# EAGLE board Yocto v2.007 (EAGLE 6.1), part 1 of 5
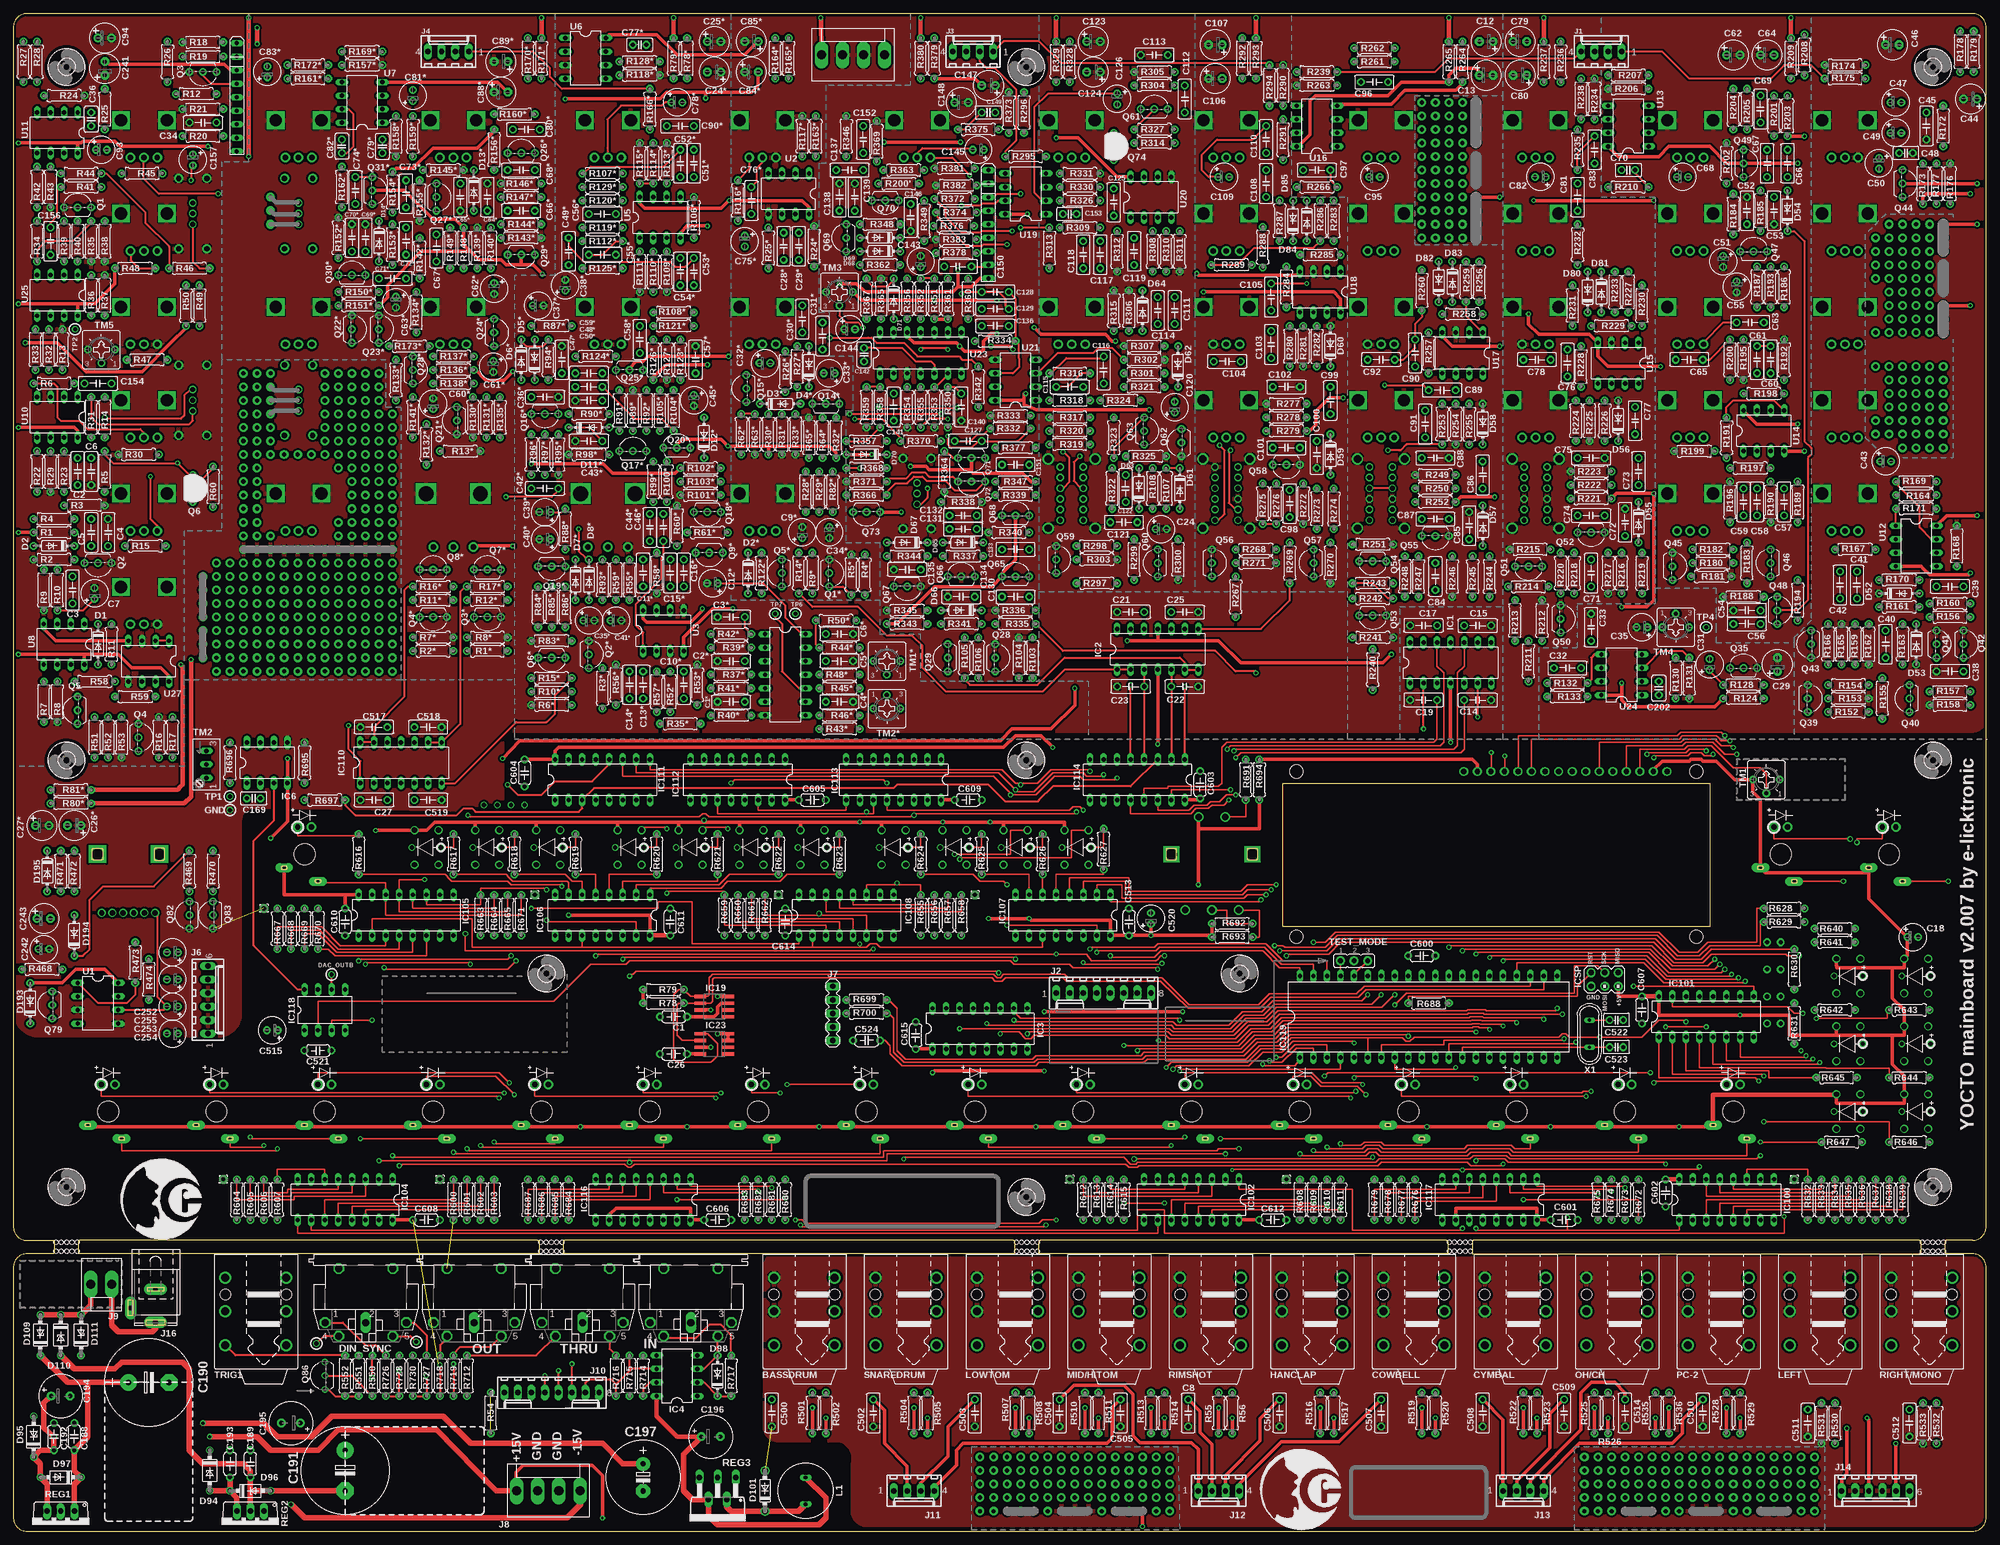
[diagram p19: board, top side]
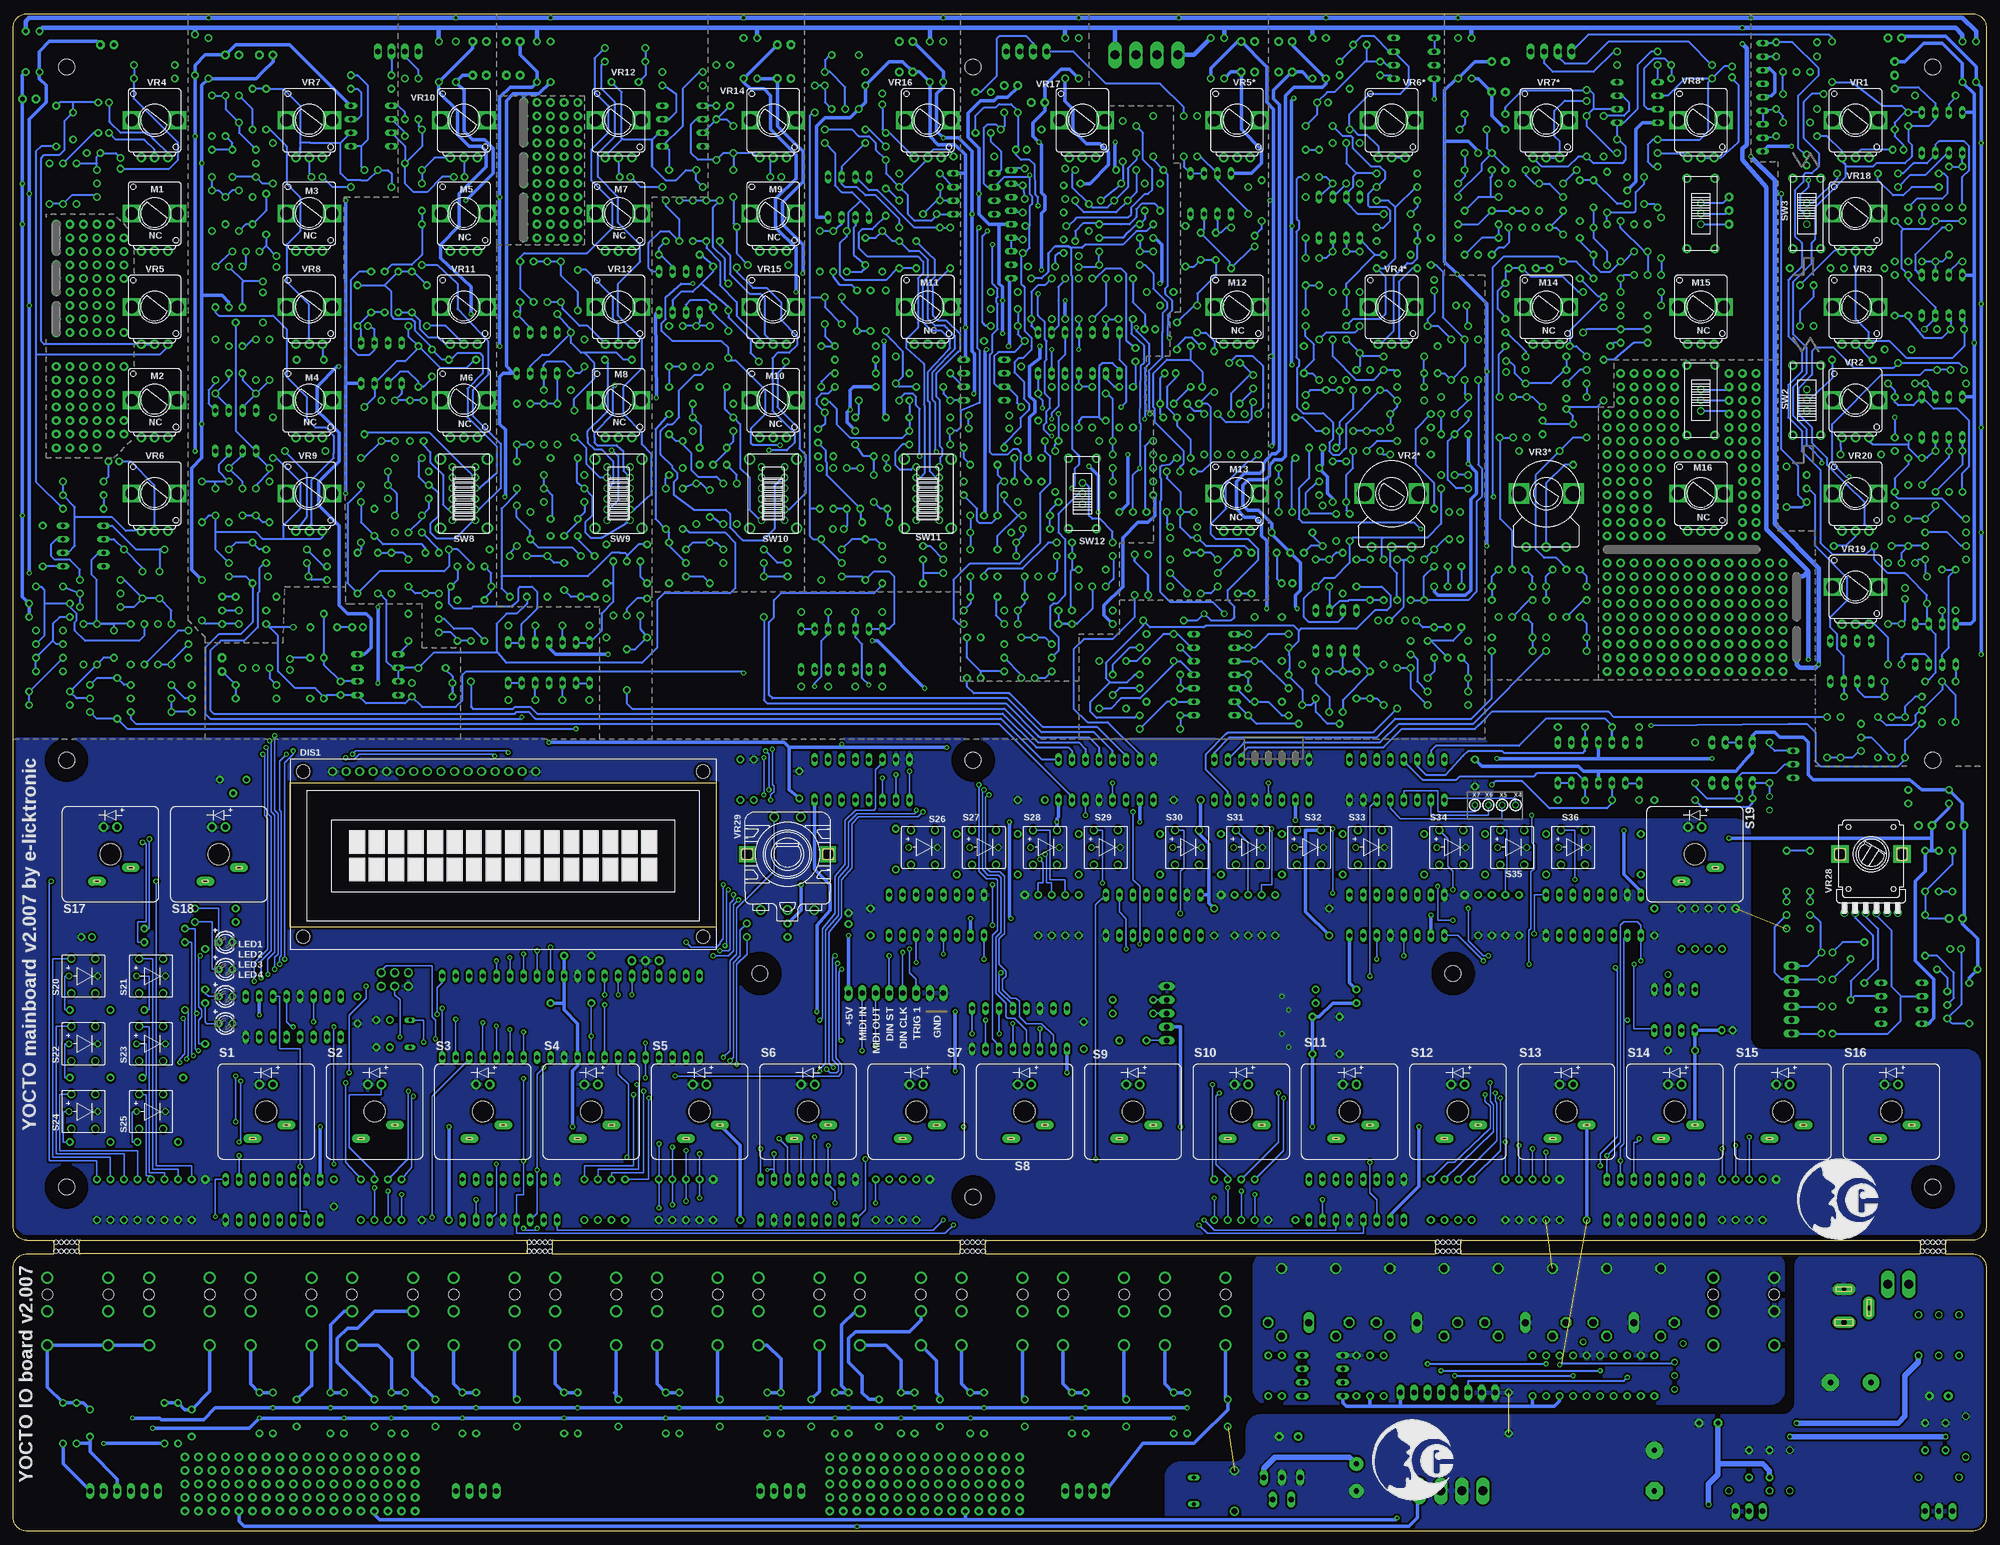
[diagram p20: board, bottom side, seen from below]

Size 370 x 284.55 mm. Coordinates in mm from the lower left corner, seen from the top.
Outline: 0,57.09 arc90 2.54,54.55 7.45,54.55 arc-90 7.7,54.3 7.7,52.25 arc-90 7.45,52 2.54,52 arc90 0,49.46 0,2.54 arc90 2.54,0 367.46,0 arc90 370,2.54 370,49.46 arc90 367.46,52 362.55,52 arc-90 362.3,52.25 362.3,54.3 arc-90 362.55,54.55 367.46,54.55 arc90 370,57.09 370,282.01 arc90 367.46,284.55 2.54,284.55 arc90 0,282.01 0,57.09
Outline: 98.35,54.55 12.55,54.55 arc90 12.3,54.3 12.3,52.25 arc90 12.55,52 98.35,52 arc90 98.6,52.25 98.6,54.3 arc90 98.35,54.55
Outline: 187.55,54.55 103.45,54.55 arc90 103.2,54.3 103.2,52.25 arc90 103.45,52 187.55,52 arc90 187.8,52.25 187.8,54.3 arc90 187.55,54.55
Outline: 268.75,54.55 192.65,54.55 arc90 192.4,54.3 192.4,52.25 arc90 192.65,52 268.75,52 arc90 269,52.25 269,54.3 arc90 268.75,54.55
Outline: 357.45,54.55 273.85,54.55 arc90 273.6,54.3 273.6,52.25 arc90 273.85,52 357.45,52 arc90 357.7,52.25 357.7,54.3 arc90 357.45,54.55
Outline: 318.13,113.29 238.12,113.29 238.12,140.28 318.13,140.28 318.13,113.29
Copper layers (1*16): Top 0.035mm / dielectric 1.5mm / Bottom 0.035mm
Design rules: minimum track width 10mil, minimum drill 10mil, track to track 8mil, track to pad 8mil, pad to pad 8mil, via to via 8mil, smd to smd 8mil, copper to edge 20mil, drill to drill 8mil, minimum pad ring 8mil, minimum via ring 8mil, stop-mask expansion 4mil, vias tented up to drill 24mil, thermal gap 10mil
Net classes: 0 default: width 0.381 mm, drill 0.254 mm, clearance 0.254 mm; 1 GND: width 0.762 mm, drill 0.254 mm, clearance 0.381 mm; 2 power: width 0.61 mm, drill 0.381 mm, clearance 0.381 mm; 3 special: width 0.254 mm, drill 0.254 mm, clearance 0.254 mm; 4 NOISE: width 0.381 mm, drill 0.254 mm, clearance 0.508 mm; 5 isolate: width 0.381 mm, drill 0.254 mm, clearance 1.016 mm
Holes 0.8 mm at 8,54.15 9,54.15 10,54.15 11,54.15 12,54.15 8,52.45 9,52.45 10,52.45 11,52.45 12,52.45 188.1,54.15 189.1,54.15 190.1,54.15 191.1,54.15 192.1,54.15 188.1,52.45 189.1,52.45 190.1,52.45 191.1,52.45 192.1,52.45 358,54.15 359,54.15 360,54.15 361,54.15 362,54.15 358,52.45 359,52.45 360,52.45 361,52.45 362,52.45 269.3,54.15 270.3,54.15 271.3,54.15 272.3,54.15 273.3,54.15 269.3,52.45 270.3,52.45 271.3,52.45 272.3,52.45 273.3,52.45 98.9,54.15 99.9,54.15 100.9,54.15 101.9,54.15 102.9,54.15 98.9,52.45 99.9,52.45 100.9,52.45 101.9,52.45 102.9,52.45

## Footprints (pad centres in the part's own frame; a part is rotated, then mirrored left to right if it is on the bottom)
JACK_TRS = drill 1.5: R -7.23,6.35; RN 4.2,6.35; S -7.23,12.7; SN 4.2,12.7; T -7.23,0; TN 4.2,0 | hole 2: -7.23,9.5; 4.2,9.5
C050-024X044 = drill 0.813 pad 1.422: 1 -2.54,0; 2 2.54,0
C050-025X075 = drill 0.813 pad 1.422: 1 -2.54,0; 2 2.54,0
E2-5 = drill 0.813 pad 1.422: + -1.016,0; - 1.016,0
E2,5-6 = drill 0.813 pad 1.6: + -1.27,0 | drill 0.813 pad 1.6 octagon: - 1.27,0
C025-025X050 = drill 0.813 pad 1.422: 1 -1.27,0; 2 1.27,0
E7,5-16 = drill 1.016 pad 3.15: + -3.81,0 | drill 1.016 pad 3.15 octagon: - 3.81,0
E3,5-8 = drill 0.813 pad 1.6: + -1.778,0 | drill 0.813 pad 1.6 octagon: - 1.778,0
E5-13 = drill 1.016 pad 2.54: + -2.54,0 | drill 1.016 pad 2.54 octagon: - 2.54,0
DO35-7C = drill 0.813 pad 1.422: A 3.81,0; C -3.81,0
DO35-7C@1 = drill 0.813 pad 1.422: A 3.81,0; C -3.81,0
DO41-7 = drill 0.9: A 3.81,0; C -3.81,0
DO41-7.6 = drill 1.1 pad 1.7: A 3.81,0; C -3.81,0
B0,8 = drill 0.8: P$1 0,0
MAB5SH = drill 1.321 octagon: 1 7.62,5.08; 3 -7.62,5.08; 4 5.08,7.62; 5 -5.08,7.62; PE -5.08,-5.08; PE@ 5.08,-5.08 | drill 1.321 long: 2 0,5.08
TUXGR_16X2_R2 = drill 1 pad 1.676: 1 -32,15.5; 2 -29.46,15.5; 3 -26.92,15.5; 4 -24.38,15.5; 5 -21.84,15.5; 6 -19.3,15.5; 7 -16.76,15.5; 8 -14.22,15.5; 9 -11.68,15.5; 10 -9.14,15.5; 11 -6.6,15.5; 12 -4.06,15.5; 13 -1.52,15.5; 14 1.02,15.5; 15 3.56,15.5; 16 6.1,15.5 | hole 2.5: -37.5,-15.5; 37.5,-15.5; -37.5,15.5; 37.5,15.5
1,6/0,8 = drill 0.813 pad 1.6 octagon: 1 0,0
DIL14 = drill 0.813 long: 1 -7.62,-3.81; 2 -5.08,-3.81; 3 -2.54,-3.81; 4 0,-3.81; 5 2.54,-3.81; 6 5.08,-3.81; 7 7.62,-3.81; 8 7.62,3.81; 9 5.08,3.81; 10 2.54,3.81; 11 0,3.81; 12 -2.54,3.81; 13 -5.08,3.81; 14 -7.62,3.81
DIL16 = drill 0.813 long: 1 -8.89,-3.81; 2 -6.35,-3.81; 3 -3.81,-3.81; 4 -1.27,-3.81; 5 1.27,-3.81; 6 3.81,-3.81; 7 6.35,-3.81; 8 8.89,-3.81; 9 8.89,3.81; 10 6.35,3.81; 11 3.81,3.81; 12 1.27,3.81; 13 -1.27,3.81; 14 -3.81,3.81; 15 -6.35,3.81; 16 -8.89,3.81
DIL08 = drill 0.813 long: 1 -3.81,-3.81; 2 -1.27,-3.81; 3 1.27,-3.81; 4 3.81,-3.81; 5 3.81,3.81; 6 1.27,3.81; 7 -1.27,3.81; 8 -3.81,3.81
DIL08' = drill 0.813 pad 1.27 long: 1 -3.81,-3.81; 2 -1.27,-3.81; 3 1.27,-3.81; 4 3.81,-3.81; 5 3.81,3.81; 6 1.27,3.81; 7 -1.27,3.81; 8 -3.81,3.81
SO08 = smd 0.6 x 2.2: 1 -1.905,-2.6; 2 -0.635,-2.6; 3 0.635,-2.6; 4 1.905,-2.6; 5 1.905,2.6; 6 0.635,2.6; 7 -0.635,2.6; 8 -1.905,2.6
DIL8 = drill 0.813 long: 1 -3.81,-3.81; 2 -1.27,-3.81; 3 1.27,-3.81; 4 3.81,-3.81; 5 3.81,3.81; 6 1.27,3.81; 7 -1.27,3.81; 8 -3.81,3.81
DIL40 = drill 0.813 long: 1 -24.13,-7.62; 2 -21.59,-7.62; 3 -19.05,-7.62; 4 -16.51,-7.62; 5 -13.97,-7.62; 6 -11.43,-7.62; 7 -8.89,-7.62; 8 -6.35,-7.62; 9 -3.81,-7.62; 10 -1.27,-7.62; 11 1.27,-7.62; 12 3.81,-7.62; 13 6.35,-7.62; 14 8.89,-7.62; 15 11.43,-7.62; 16 13.97,-7.62; 17 16.51,-7.62; 18 19.05,-7.62; 19 21.59,-7.62; 20 24.13,-7.62; 21 24.13,7.62; 22 21.59,7.62; 23 19.05,7.62; 24 16.51,7.62; 25 13.97,7.62; 26 11.43,7.62; 27 8.89,7.62; 28 6.35,7.62; 29 3.81,7.62; 30 1.27,7.62; 31 -1.27,7.62; 32 -3.81,7.62; 33 -6.35,7.62; 34 -8.89,7.62; 35 -11.43,7.62; 36 -13.97,7.62; 37 -16.51,7.62; 38 -19.05,7.62; 39 -21.59,7.62; 40 -24.13,7.62
MA03-2 = drill 1.016 pad 1.676: 1 -2.54,-1.27; 2 -2.54,1.27; 3 0,-1.27; 4 0,1.27; 5 2.54,-1.27; 6 2.54,1.27
6410-04 = drill 1.016 long: 1 3.81,0; 2 1.27,0; 3 -1.27,0; 4 -3.81,0
6410-08 = drill 1.016 long: 1 8.89,0; 2 6.35,0; 3 3.81,0; 4 1.27,0; 5 -1.27,0; 6 -3.81,0; 7 -6.35,0; 8 -8.89,0
KK-156-4 = drill 1.7 pad 2.184 long: 1 -5.94,0; 2 -1.98,0; 3 1.98,0; 4 5.94,0
6410-06 = drill 1.016 long: 1 6.35,0; 2 3.81,0; 3 1.27,0; 4 -1.27,0; 5 -3.81,0; 6 -6.35,0
MA05-1A = drill 1.016 long: 1 -5.08,0; 2 -2.54,0; 3 0,0; 4 2.54,0; 5 5.08,0
KK-156-2 = drill 1.7 pad 2.184 long: 1 -1.98,0; 2 1.98,0
JACK_PSU_2.1MM = drill 0.8 pad 2.184 long: 1 -3.5,0; 2 0,-4.7 | drill 1 pad 2.184 long: 3 2.7,0
BS11 = drill 0.7 long: 1 -2.5,0; 2 2.5,0
LED3MM = drill 0.813 pad 1.422: A -1.27,0; K 1.27,0
R0903N = drill 1 pad 1.778: 1 -2.5,-7; 2 0,-7; 3 2.5,-7 | drill 2.3 square: P$4 -4.3,0; P$5 4.3,0
MSS12_SW_SLIDE = drill 0.9: 1 -2,0; 2 0,0; 3 2,0 | drill 1 pad 1.676: P$4 -6.6,2.65; P$5 6.6,2.65; P$6 6.6,-2.65; P$7 -6.6,-2.65
1.6/0.8ROUND = drill 0.813 pad 1.6: 1 0,0
TO-92-ECB-PERSO = drill 0.813 pad 1.422: B 2.54,0; C 0,0; E -2.54,0
TO-92-ECB-MARKED = drill 0.8 pad 1.422: B 2.54,0; C 0,0; E -2.54,0
TO-92-MARKED_FET = drill 0.813 pad 1.422: D 2.54,0; G 0,0; S -2.54,0
TO-ECB-MARKED2 = drill 0.8 pad 1.422: B 2.54,0; C 0,0; E -2.54,0
TO92-ECB = drill 0.813 pad 1.422: B 2.54,0; C 0,0; E -2.54,0
TO92-EBC-SMALL = drill 0.813: B 0,0; C -2.54,0; E 2.54,0
0207/7 = drill 0.813 pad 1.422: 1 -3.81,0; 2 3.81,0
TO220V = drill 1.016 long: 1 -2.54,-2.54; 2 0,-2.54; 3 2.54,-2.54
T05D = drill 1.016 long: 1 -3.404,-5.08; 2 -1.702,-0.914; 3 0,-5.08; 4 1.702,-0.914; 5 3.404,-5.08
MX1A-SW = drill 0.5 pad 1.676 long: 1 -2.54,-5.08; 2 3.81,-2.54 | drill 1 pad 1.778: A 1.27,5.08; K -1.27,5.08 | hole 3.95: 0,0
SPH_SW = drill 1: 1 -2.25,3.25; 2 -2.25,-3.25; 3 2.25,3.25; 4 2.25,-3.25 | drill 0.8: A -2.7,0; K 2.7,0
MSS42_SW_SLIDE = drill 0.9: 1A -2.15,5; 1B 2.15,5; 1C -2.15,-1; 1D 2.15,-1; 2A -2.15,1; 2B 2.15,1; 2C -2.15,-5; 2D 2.15,-5; CA -2.15,3; CB 2.15,3; CC -2.15,-3; CD 2.15,-3 | drill 1.4: P$1 -4.4,6.5; P$2 4.4,6.5; P$3 4.4,-6.5; P$4 -4.4,-6.5
JP2 = drill 0.914 pad 1.676: 1 -2.54,0; 2 0,0; 3 2.54,0
CT6 = drill 0.813 pad 1.422: A 2.515,0; E -2.515,0; S 0,-2.54
S64W = drill 0.813 long: A 2.54,1.27; E -2.54,1.27; S 0,1.27
SIL09 = drill 0.8 long: 1 10.16,0; 2 7.62,0; 3 5.08,0; 4 2.54,0; 5 0,0; 6 -2.54,0; 7 -5.08,0; 8 -7.62,0; 9 -10.16,0
3,0 = hole 3: 0,0
R1212N = drill 1 pad 1.778: 1 -3.75,-10; 2 0,-10; 3 3.75,-10 | drill 2.8 square: P$4 -5.1,0; P$5 5.1,0
PTV112-4 = drill 1: 1 -3,-11; 1' -1,-11; 2 -5,-11; 2' 1,-11; 3 5,-11; 3' 3,-11 | drill 2 pad 3.302 square: P$1 -5.8,0; P$2 5.8,0
PEC16_ENCODER = drill 1.2: A -5,-10.5; B 0,-10.5; C 5,-10.5; D -2.5,7; E 2.5,7 | drill 2 square: P$6 -7.6,0; P$7 7.6,0
QS = drill 0.61 long: 1 -2.54,0; 2 2.54,0

## Placement (x,y rotation side)
BASSDRUM  JACK_TRSNRJ6HF  [JACK_TRS]  149.86,34.87 0 top
C1  0.1  [C050-024X044]  123.83,96.46 180 top
C1*  18n  [C050-025X075]  134.62,155.52 0 top
C2  3n3  [C050-025X075]  12.06,198.7 270 top
C2*  10n  [C050-025X075]  134.62,163.14 0 top
C3  47n  [C050-025X075]  11.11,176.47 90 top
C3*  10n  [C050-025X075]  134.62,171.39 0 top
C4  47n  [C050-025X075]  17.78,187.27 270 top
C4*  18n  [C050-025X075]  154.94,155.52 180 top
C5  47n  [C050-025X075]  14.61,187.27 270 top
C5*  18n  [C050-025X075]  154.94,163.14 180 top
C6  47n  [C050-025X075]  14.61,198.7 90 top
C6*  22n  [C050-025X075]  154.94,168.22 180 top
C7  2.2/50  [E2-5]  15.24,175.84 90 top
C8  0.01  [C050-025X075]  220.34,22.17 90 top
C9*  .47/50  [E2-5]  147.96,187.27 90 top
C10*  3.3n  [C050-025X075]  125.73,158.69 90 top
C11*  1n  [C050-025X075]  118.11,179.65 90 top
C12  47/16  [E2,5-6]  276.23,279.34 180 top
C12*  100/6.3  [E2-5]  131.13,177.74 180 top
C13  47/16  [E2,5-6]  276.23,272.99 0 top
C13*  6.8n  [C050-025X075]  118.11,158.69 270 top
C14  470p  [C050-025X075]  274.64,155.84 0 top
C14*  6.8n  [C050-025X075]  115.57,158.69 90 top
C15  470p  [C050-025X075]  274.64,169.81 0 top
C15*  3.3n  [C050-025X075]  123.19,179.65 90 top
C16*  3.3n  [C050-025X075]  125.73,179.65 270 top
C17  470p  [C050-025X075]  264.48,169.81 180 top
C18  100/6.3  [E2-5]  356.24,111.39 0 top
C19  470p  [C050-025X075]  264.48,155.84 180 top
C21  470p  [C050-025X075]  209.55,172.34 180 top
C22  470p  [C050-025X075]  219.71,158.38 0 top
C23  470p  [C050-025X075]  209.55,158.38 180 top
C24  .47/50  [E2-5]  215.26,187.9 0 top
C24*  47/16  [E2,5-6]  131.44,273.63 180 top
C25  470p  [C050-025X075]  219.71,172.34 0 top
C25*  47/16  [E2,5-6]  131.44,279.34 0 top
C26  0.1  [C050-024X044]  123.83,89.48 180 top
C26*  47/16  [E2,5-6]  11.43,132.34 180 top
C27  470p  [C050-025X075]  67.63,137.1 180 top
C27*  47/16  [E2,5-6]  5.4,132.34 0 top
C28*  10n  [C050-025X075]  144.46,240.93 90 top
C29  47/16  [E2,5-6]  330.83,162.5 90 top
C29*  3.3n  [C050-025X075]  147.32,240.93 90 top
C30*  2.2n  [C050-025X075]  147.96,227.27 90 top
C31  1/50  [E2-5]  318.13,162.5 90 top
C31*  2.2n  [C050-025X075]  151.76,224.1 90 top
C32  39n  [C050-025X075]  291.46,161.87 0 top
C32*  10/16  [E2-5]  140.97,219.02 0 top
C33  18n  [C050-025X075]  295.91,169.49 90 top
C33*  10/16  [E2-5]  153.03,217.11 180 top
C34  1n  [C050-025X075]  35.56,264.1 0 top
C34*  1/50  [E2-5]  153.03,187.27 270 top
C35  10/16  [E2-5]  305.44,169.49 180 top
C35*  47/16  [E2-5]  107.95,170.76 0 top
C36  220p  [C025-025X050]  14.61,264.74 270 top
C36*  1.5n  [C050-025X075]  99.69,212.67 0 top
C37*  2.2/50  [E2-5]  98.42,229.81 0 top
C38  100n  [C050-025X075]  363.22,161.23 180 top
C38*  1/50  [E2-5]  103.5,233.62 90 top
C39  33n  [C050-025X075]  363.22,177.11 180 top
C39*  .47/50  [E2-5]  99.69,191.08 180 top
C40  15n  [C050-025X075]  351.15,166.31 90 top
C40*  1/50  [E2-5]  99.69,186 180 top
C41  15n  [C050-025X075]  345.76,177.43 270 top
C41*  1/50  [E2-5]  113.03,170.76 0 top
C42  15n  [C050-025X075]  342.58,177.43 90 top
C42*  22n  [C050-025X075]  99.69,195.52 180 top
C43  33/6.3  [E2-5]  351.15,200.6 0 top
C43*  1.5n  [C050-025X075]  107.95,204.41 0 top
C44  47/16  [E2,5-6]  367.03,268.55 180 top
C44*  22n  [C050-025X075]  119.38,188.22 90 top
C45  100n  [C050-025X075]  358.77,263.47 270 top
C45*  2.2/50  [E2-5]  127.64,212.03 270 top
C46  47/16  [E2,5-6]  352.43,278.71 0 top
C46*  22n  [C050-025X075]  121.92,188.22 90 top
C47  .47/50  [E2-5]  353.06,267.91 0 top
C47*  1.5n  [C050-025X075]  102.87,219.65 90 top
C48  220p  [C025-025X050]  354.96,258.39 180 top
C48*  1.5n  [C050-025X075]  107.95,214.57 180 top
C49  .47/50  [E2-5]  353.06,262.2 0 top
C49*  3.3n  [C050-025X075]  104.14,239.97 90 top
C50  1/50  [E2-5]  349.88,256.48 270 top
C50*  1.5n  [C050-025X075]  107.95,212.03 0 top
C51  .47/50  [E2-5]  320.68,238.07 270 top
C51*  1n  [C050-025X075]  127.64,256.48 90 top
C52  100n  [C050-025X075]  325.12,247.59 90 top
C52*  1n  [C050-025X075]  125.09,256.48 270 top
C53  1n  [C050-025X075]  330.2,247.59 270 top
C53*  1n  [C050-025X075]  127.64,236.16 270 top
C54  2.7n  [C050-025X075]  325.12,172.66 180 top
C54*  1n  [C050-025X075]  125.09,236.16 90 top
C55  47/16  [E2-5]  323.21,233.31 270 top
C55*  10n  [C050-025X075]  110.49,239.34 180 top
C56  22n  [C050-025X075]  325.12,170.12 180 top
C56*  10n  [C050-025X075]  110.49,246.96 180 top
C57  6.8n  [C050-025X075]  332.11,192.98 90 top
C57*  3.3n  [C050-025X075]  127.95,219.65 90 top
C58  27n  [C050-025X075]  327.02,192.98 270 top
C58*  10n  [C050-025X075]  117.47,223.46 90 top
C59  27n  [C050-025X075]  324.49,192.98 90 top
C59*  1.5n  [C050-025X075]  107.95,217.11 0 top
C60  6.8n  [C050-025X075]  329.56,219.65 90 top
C60*  10/16  [E2-5]  78.74,211.4 90 top
C61  6.8n  [C050-025X075]  327.02,219.65 270 top
C61*  47/16  [E2-5]  90.01,218.38 270 top
C62  47/16  [E2,5-6]  322.58,276.8 0 top
C62*  .47/50  [E2-5]  90.17,232.99 270 top
C63  47n  [C050-025X075]  325.75,226.64 180 top
C63*  .47/50  [E2-5]  71.75,230.45 270 top
C64  47/16  [E2,5-6]  328.93,276.8 0 top
C64*  1.5n  [C050-025X075]  88.9,250.13 90 top
C65  47n  [C050-025X075]  314.32,219.65 180 top
C65*  1.5n  [C050-025X075]  83.82,250.13 270 top
C66  1.8n  [C050-025X075]  332.74,256.48 90 top
C66*  1.5n  [C050-025X075]  95.25,247.59 0 top
C67  1.8n  [C050-025X075]  328.93,256.48 270 top
C67*  22n  [C050-025X075]  79.38,240.61 90 top
C68  33/6.3  [E2-5]  313.06,253.94 0 top
C68*  1.5n  [C050-025X075]  95.25,255.21 0 top
C69  10n  [C050-025X075]  327.66,266.64 90 top
C69*  1.5n  [C050-025X075]  66.04,242.51 90 top
C70  220p  [C025-025X050]  302.89,255.21 0 top
C70*  1.5n  [C050-025X075]  63.5,242.51 90 top
C71  47n  [C050-025X075]  295.91,179.65 90 top
C71*  22n  [C050-025X075]  71.12,234.89 180 top
C72  39n  [C050-025X075]  302.26,189.17 90 top
C72*  1n  [C050-025X075]  73.66,241.88 90 top
C73  6.8n  [C050-025X075]  304.8,198.7 90 top
C73*  1n  [C050-025X075]  73.66,250.77 90 top
C74  47n  [C050-025X075]  295.91,190.44 0 top
C74*  470p  [C050-025X075]  64.14,251.4 270 top
C75  18n  [C050-025X075]  295.91,201.24 0 top
C75*  1/50  [E2-5]  137.16,241.88 270 top
C76  56n  [C050-025X075]  291.46,219.02 90 top
C76*  22n  [C050-025X075]  138.43,249.5 270 top
C77  47n  [C050-025X075]  304.17,208.22 270 top
C77*  220p  [C025-025X050]  117.47,278.71 0 top
C78  12n  [C050-025X075]  285.75,219.65 180 top
C78*  33/6.3  [E2-5]  124.46,267.91 0 top
C79  47/16  [E2,5-6]  282.57,279.34 0 top
C79*  220p  [C025-025X050]  69.22,259.66 90 top
C80  47/16  [E2,5-6]  282.57,272.99 180 top
C80*  470p  [C050-025X075]  96.2,262.83 0 top
C81  47n  [C050-025X075]  293.37,250.13 90 top
C81*  33/6.3  [E2-5]  74.93,269.18 90 top
C82  33/6.3  [E2-5]  286.38,253.94 180 top
C82*  220p  [C025-025X050]  61.59,259.66 270 top
C83  1n  [C050-025X075]  296.55,259.02 270 top
C83*  33/6.3  [E2-5]  47.62,273.63 90 top
C84  47n  [C050-025X075]  266.7,179.01 90 top
C84*  47/16  [E2,5-6]  138.43,273.63 0 top
C85  33n  [C050-025X075]  273.05,188.54 90 top
C85*  47/16  [E2,5-6]  138.43,279.34 180 top
C86  2.7n  [C050-025X075]  275.59,198.06 90 top
C87  33n  [C050-025X075]  266.7,189.81 0 top
C88  15n  [C050-025X075]  266.7,201.24 0 top
C88*  47/16  [E2,5-6]  91.44,269.82 0 top
C89  8.2n  [C050-025X075]  267.97,213.94 0 top
C89*  47/16  [E2,5-6]  91.44,275.53 180 top
C90  27n  [C050-025X075]  262.89,220.92 90 top
C90*  10n  [C050-025X075]  125.09,263.47 0 top
C91  27n  [C050-025X075]  264.8,207.59 270 top
C92  12n  [C050-025X075]  256.54,219.65 180 top
C93  33/6.3  [E2-5]  16.51,259.02 0 top
C94  47/16  [E2,5-6]  17.14,279.98 0 top
C95  33/6.3  [E2-5]  255.27,253.94 0 top
C96  39n  [C050-025X075]  255.27,271.72 0 top
C97  1n  [C050-025X075]  244.47,255.21 0 top
C98  47n  [C050-025X075]  239.4,192.67 90 top
C99  2.7n  [C050-025X075]  247.01,212.03 90 top
C100  33n  [C050-025X075]  244.47,201.87 270 top
C101  27n  [C050-025X075]  238.76,203.14 0 top
C102  10n  [C050-025X075]  238.76,214.57 0 top
C103  27n  [C050-025X075]  235.9,222.51 270 top
C104  22n  [C050-025X075]  227.65,219.34 180 top
C105  5.6n  [C050-025X075]  235.9,231.4 270 top
C106  47/16  [E2,5-6]  225.43,272.36 0 top
C107  47/16  [E2,5-6]  225.43,278.71 180 top
C108  33n  [C050-025X075]  234.95,252.67 90 top
C109  33/6.3  [E2-5]  227.01,253.94 0 top
C110  1n  [C050-025X075]  234.95,260.93 90 top
C111  10n  [C050-025X075]  217.81,228.86 270 top
C112  22n  [C050-025X075]  219.71,268.55 90 top
C113  47n  [C050-025X075]  214,276.8 180 top
C114  1n  [C050-025X075]  214.63,228.86 270 top
C115  4.7n  [C050-025X075]  198.12,214.57 0 top
C116  4.7n  [C050-025X075]  204.47,217.75 90 top
C117  2.2n  [C050-025X075]  203.84,239.34 90 top
C118  2.2n  [C050-025X075]  200.66,239.34 90 top
C119  2.2n  [C050-025X075]  210.19,239.97 270 top
C120  10/16  [E2-5]  217.81,210.76 90 top
C121  4.7n  [C050-025X075]  208.28,189.17 180 top
C122  4.7n  [C050-025X075]  208.6,195.52 90 top
C123  47/16  [E2,5-6]  202.56,279.34 0 top
C124  47/16  [E2,5-6]  202.56,273.63 180 top
C125  10n  [C050-025X075]  206.38,249.18 90 top
C126  33/6.3  [E2-5]  207.01,268.55 270 top
C127  1.8n  [C050-025X075]  179.07,204.41 0 top
C128  4.7n  [C050-025X075]  184.15,232.35 180 top
C129  4.7n  [C050-025X075]  184.15,229.18 180 top
C130  47n  [C050-025X075]  187.96,175.2 0 top
C131  10n  [C050-025X075]  178.12,187.9 0 top
C132  1n  [C050-025X075]  178.12,190.44 180 top
C133  1n  [C050-025X075]  187.96,184.09 180 top
C134  33n  [C050-025X075]  177.8,175.2 180 top
C135  100n  [C050-025X075]  167.64,180.28 180 top
C136  22n  [C050-025X075]  184.15,226 0 top
C137  33n  [C050-025X075]  156.84,255.21 0 top
C138  47n  [C050-025X075]  154.94,250.13 90 top
C139  18n  [C050-025X075]  157.8,250.13 270 top
C140  27n  [C050-025X075]  177.8,210.76 90 top
C141  1n  [C050-025X075]  165.1,210.76 90 top
C142  220p  [C025-025X050]  159.54,220.61 90 top
C143  1/50  [E2-5]  170.18,238.07 90 top
C144  .47/50  [E2-5]  156.84,225.37 0 top
C145  33/6.3  [E2-5]  180.97,259.02 180 top
C146  18n  [C050-025X075]  168.28,246.32 270 top
C147  47/16  [E2,5-6]  182.88,271.09 180 top
C148  47/16  [E2,5-6]  177.8,267.91 0 top
C149  220p  [C025-025X050]  182.88,266.01 0 top
C150  1n  [C050-025X075]  177.16,237.12 180 top
C151  10n  [C050-025X075]  187.96,199.97 180 top
C152  4.7n  [C050-025X075]  159.38,260.93 90 top
C153  22p  [C025-025X050]  198.12,246.96 180 top
C154  22n  [C050-025X075]  15.88,215.21 180 top
C156  1n  [C050-025X075]  6.99,241.88 270 top
C157  1/50  [E2-5]  33.66,257.12 270 top
C169  47p  [C025-025X050]  45.09,137.42 180 top
C188  0.1  [C050-024X044]  11.43,17.72 90 top
C189  0.1  [C050-024X044]  44.45,12.64 270 top
C190  2200/35  [E7,5-16]  25.4,27.88 0 top
C191  2200/35  [E7,5-16]  62.23,11.37 270 top
C192  0.1  [C050-024X044]  7.62,17.72 90 top
C193  0.1  [C050-024X044]  40.64,12.64 270 top
C194  100/35  [E3,5-8]  8.89,25.34 0 top
C195  100/35  [E3,5-8]  52.07,20.26 180 top
C196  220/35  [E3,5-8]  130.81,17.72 0 top
C197  680/35  [E5-13]  118.11,10.1 270 top
C202  22p  [C025-025X050]  308.61,158.06 270 top
C241  47/16  [E2,5-6]  17.14,274.26 90 top
C242  10/16  [E2-5]  5.71,109.16 0 top
C243  47/35  [E2,5-6]  5.71,114.88 0 top
C252  10/16  [E2-5]  29.84,108.53 180 top
C253  10/16  [E2-5]  29.84,98.37 180 top
C254  10/16  [E2-5]  29.84,93.29 180 top
C255  10/16  [E2-5]  29.84,103.45 180 top
C500  0.01  [C050-025X075]  142.24,22.17 90 top
C502  0.01  [C050-025X075]  161.29,22.17 90 top
C503  0.01  [C050-025X075]  180.34,22.17 90 top
C504  0.01  [C050-025X075]  196.22,22.17 90 top
C505  0.01  [C050-025X075]  207.65,22.17 90 top
C506  0.01  [C050-025X075]  237.49,22.17 90 top
C507  0.01  [C050-025X075]  256.54,22.17 90 top
C508  0.01  [C050-025X075]  275.59,22.17 90 top
C509  0.01  [C050-025X075]  290.83,22.17 90 top
C510  0.01  [C050-025X075]  316.87,22.17 90 top
C511  0.01  [C050-025X075]  336.55,20.26 90 top
C512  0.01  [C050-025X075]  355.6,20.26 90 top
C513  0.1  [C050-024X044]  209.23,114.24 270 top
C514  0.01  [C050-025X075]  302.26,22.17 90 top
C515  100/10  [E2-5]  48.58,93.92 180 top
C517  470p  [C050-025X075]  67.63,150.75 180 top
C518  470p  [C050-025X075]  77.79,150.75 0 top
C519  470p  [C050-025X075]  77.79,137.1 0 top
C520  100/10  [E2-5]  213.36,114.88 90 top
C521  0.1  [C050-024X044]  57.15,90.11 180 top
C522  22p  [C025-025X050]  300.67,95.83 180 top
C523  22p  [C025-025X050]  300.67,90.75 180 top
C524  0.1  [C050-024X044]  160.02,92.02 180 top
C600  0.1  [C050-024X044]  264.16,107.89 0 top
C601  0.1  [C050-024X044]  290.83,58.36 180 top
C602  0.1  [C050-024X044]  309.88,63.44 90 top
C603  0.1  [C050-024X044]  222.57,139.96 270 top
C604  0.1  [C050-024X044]  95.89,142.18 90 top
C605  0.1  [C050-024X044]  149.86,137.1 180 top
C606  0.1  [C050-024X044]  132.08,58.36 180 top
C607  0.1  [C050-024X044]  305.44,97.73 90 top
C608  0.1  [C050-024X044]  77.47,58.36 180 top
C609  0.1  [C050-024X044]  179.07,137.1 180 top
C610  0.1  [C050-024X044]  62.23,114.24 90 top
C611  0.1  [C050-024X044]  123.19,114.24 270 top
C612  0.1  [C050-024X044]  236.22,58.36 180 top
C614  0.1  [C050-024X044]  144.78,114.24 90 top
C615  0.1  [C050-024X044]  169.23,92.97 270 top
COWBELL  JACK_TRSNRJ6HF  [JACK_TRS]  264.16,34.87 0 top
CYMBAL  JACK_TRSNRJ6HF  [JACK_TRS]  283.21,34.87 0 top
D1  1N4148  [DO35-7C]  15.88,166.31 270 top
D2  1N4148  [DO35-7C]  7.62,184.73 180 top
D2*  1N4148  [DO35-7C]  137.79,179.65 270 top
D3*  1N4148  [DO35-7C]  143.83,211.4 0 top
D4*  1N4148  [DO35-7C]  149.22,218.38 90 top
D5*  1N4148  [DO35-7C]  97.79,219.65 90 top
D6*  1N4148  [DO35-7C]  95.25,219.65 270 top
D7*  1N4148  [DO35-7C]  105.41,178.38 270 top
D8*  1N4148  [DO35-7C]  107.95,178.38 270 top
D11*  1N4148  [DO35-7C]  107.95,206.95 0 top
D12*  1N4148  [DO35-7C]  129.54,205.05 90 top
D13*  1N4148  [DO35-7C]  86.36,251.4 270 top
D14*  1N4148  [DO35-7C]  68.58,241.88 270 top
D52  1N4148DO35-7  [DO35-7C@1]  353.69,175.84 0 top
D53  1N4148DO35-7  [DO35-7C@1]  356.87,166.31 270 top
D54  1N4148  [DO35-7C]  332.74,247.59 90 top
D55  1N4148  [DO35-7C]  304.8,189.17 270 top
D56  1N4148  [DO35-7C]  300.99,208.22 90 top
D57  1N4148  [DO35-7C]  275.59,188.54 270 top
D58  1N4148  [DO35-7C]  275.59,207.59 90 top
D59  1N4148  [DO35-7C]  247.01,201.87 270 top
D60  1N4148  [DO35-7C]  247.01,222.19 90 top
D61  1N4148  [DO35-7C]  218.76,195.52 270 top
D62  1N4148  [DO35-7C]  218.44,218.38 90 top
D63  1N4148  [DO35-7C]  211.14,195.52 90 top
D64  1N4148  [DO35-7C]  211.77,228.86 270 top
D65  1N4148  [DO35-7C]  178.12,185.36 180 top
D66  1N4148  [DO35-7C]  177.8,172.66 180 top
D67  1N4148  [DO35-7C]  167.64,185.36 180 top
D68  1N4148  [DO35-7C]  162.56,239.97 180 top
D69  1N4148  [DO35-7C]  162.56,242.51 180 top
D70  1N4148  [DO35-7C]  160.02,201.87 180 top
D71  1N4148  [DO35-7C]  165.1,231.08 270 top
D80  1N34  [DO35-7C]  295.27,232.35 90 top
D81  1N34  [DO35-7C]  297.81,232.35 270 top
D82  1N34  [DO35-7C]  267.33,234.26 90 top
D83  1N34  [DO35-7C]  269.88,234.26 270 top
D84  1N34  [DO35-7C]  240.03,245.69 90 top
D85  1N34  [DO35-7C]  242.57,245.69 270 top
D94  1N4004  [DO41-7]  36.83,11.37 270 top
D95  1N4004  [DO41-7]  3.81,17.72 90 top
D96  1N4004  [DO41-7]  44.45,7.56 0 top
D97  1N4004  [DO41-7]  8.89,10.1 180 top
D98  1N4148  [DO35-7C]  132.08,29.15 90 top
D101  1N5819-B  [DO41-7.6]  140.97,7.56 90 top
D109  1N4004  [DO41-7]  5.08,36.77 90 top
D110  1N4004  [DO41-7]  8.89,36.77 270 top
D111  1N4004  [DO41-7]  12.7,36.77 90 top
D193  1N4148  [DO35-7C]  3.17,99 90 top
D194  1N4148  [DO35-7C]  11.43,111.7 90 top
D195  1N4148  [DO35-7C]  6.35,123.77 270 top
DAC_OUTB  TPB0,8  [B0,8]  59.69,104.4 0 top
DIN_4  TPB0,8  [B0,8]  56.83,35.19 0 top
DIN_5  TPB0,8  [B0,8]  75.56,35.5 0 top
DIN_SYNC  [MAB5SH]  66.1,44.18 180 top
DIS1  TUXGR_16X2_R2  [TUXGR_16X2_R2]  278.13,126.94 0 bottom
G1  [1,6/0,8]  39.37,65.98 0 top
G2  [1,6/0,8]  80.01,65.98 0 top
G3  [1,6/0,8]  198.12,65.98 0 top
G4  [1,6/0,8]  238.76,65.98 0 top
G5  [1,6/0,8]  334.01,65.98 0 top
G6  [1,6/0,8]  180.34,119.32 0 top
G7  [1,6/0,8]  143.51,119.32 0 top
G8  [1,6/0,8]  97.79,119.32 0 top
G9  [1,6/0,8]  46.99,116.78 0 top
GND  TPB0,8  [B0,8]  40.64,135.2 0 top
HANCLAP  JACK_TRSNRJ6HF  [JACK_TRS]  245.11,34.87 0 top
IC1  TL074P  [DIL14]  269.56,162.82 0 top
IC2  TL074P  [DIL14]  214.63,165.36 0 top
IC3  4049N  [DIL16]  181.29,94.24 0 top
IC4  6N138  [DIL08]  124.46,29.15 90 top
IC6  TL072P  [DIL08']  47.62,144.09 0 top
IC19  M24M02MN  [SO08]  131.44,98.37 90 top
IC23  M24M02MN  [SO08]  131.44,91.38 90 top
IC100  74HC165N  [DIL16]  321.31,62.17 0 top
IC101  74HC595N  [DIL16]  317.5,96.46 0 top
IC102  74HC165N  [DIL16]  220.98,62.17 180 top
IC104  74HC165N  [DIL16]  62.23,62.17 180 top
IC105  74HC165N  [DIL16]  73.66,115.51 0 top
IC106  74HC595N  [DIL16]  110.49,115.51 180 top
IC107  74HC595N  [DIL16]  196.85,115.51 180 top
IC108  74HC165N  [DIL16]  156.21,115.51 0 top
IC110  TL074P  [DIL14]  72.71,144.09 0 top
IC111  4051N  [DIL16]  110.49,140.91 0 top
IC112  74HC595N  [DIL16]  135.89,140.91 180 top
IC113  74HC595N  [DIL16]  165.1,140.91 180 top
IC114  4051N  [DIL16]  210.82,140.91 180 top
IC116  74HC595N  [DIL16]  118.11,62.17 180 top
IC117  74HC595N  [DIL16]  276.86,62.17 180 top
IC118  MCP4822  [DIL8]  58.42,97.73 0 top
IC119  ATMEGA1284P-20PU  [DIL40]  265.43,96.46 0 top
ICSP  [MA03-2]  298.45,103.45 180 top
IN  [MAB5SH]  127.06,44.18 180 top
J1  [6410-04]  297.81,277.44 0 top
J2  [6410-08]  204.47,100.91 180 top
J3  [6410-04]  180,277.44 0 top
J4  [6410-04]  81.6,277.44 0 top
J5  [KK-156-4]  157.48,276.8 0 top
J6  22-27-2061-06  [6410-06]  36.51,99.64 270 top
J7  [MA05-1A]  153.67,97.1 270 top
J8  [KK-156-4]  100.33,7.56 0 top
J9  [KK-156-2]  16.51,46.3 180 top
J10  [6410-08]  100.97,25.98 180 top
J11  [6410-04]  168.91,7.56 180 top
J12  [6410-04]  226.06,7.56 180 top
J13  [6410-04]  283.21,7.56 180 top
J14  22-27-2061-06  [6410-06]  349.25,7.56 180 top
J16  [JACK_PSU_2.1MM]  26.67,41.85 270 top
L1  33u  [BS11]  148.59,7.56 270 top
LED1  [LED3MM]  330.2,110.43 0 bottom
LED2  [LED3MM]  330.2,105.35 0 bottom
LED3  [LED3MM]  330.2,100.27 0 bottom
LED4  [LED3MM]  330.2,95.19 0 bottom
LEFT  JACK_TRSNRJ6HF  [JACK_TRS]  340.36,34.87 0 top
LOWTOM  JACK_TRSNRJ6HF  [JACK_TRS]  187.96,34.87 0 top
M1  NC  [R0903N]  343.5,247.05 0 bottom
M2  NC  [R0903N]  343.5,212.05 0 bottom
M3  NC  [R0903N]  314.5,247.05 0 bottom
M4  NC  [R0903N]  314.5,212.05 0 bottom
M5  NC  [R0903N]  285.5,247.05 0 bottom
M6  NC  [R0903N]  285.5,212.05 0 bottom
M7  NC  [R0903N]  256.5,247.05 0 bottom
M8  NC  [R0903N]  256.5,212.05 0 bottom
M9  NC  [R0903N]  227.5,247.05 0 bottom
M10  NC  [R0903N]  227.5,212.05 0 bottom
M11  NC  [R0903N]  198.5,229.55 0 bottom
M12  NC  [R0903N]  140.5,229.55 0 bottom
M13  NC  [R0903N]  140.5,194.55 0 bottom
M14  NC  [R0903N]  82.5,229.55 0 bottom
M15  NC  [R0903N]  53.5,229.55 0 bottom
M16  NC  [R0903N]  53.5,194.55 0 bottom
MID/HITOM  JACK_TRSNRJ6HF  [JACK_TRS]  207.01,34.87 0 top
MSW1  MSS12  [MSS12_SW_SLIDE]  53.5,247.05 270 bottom
MSW2  MSS12  [MSS12_SW_SLIDE]  53.5,212.05 270 bottom
OH/CH  JACK_TRSNRJ6HF  [JACK_TRS]  302.26,34.87 0 top
OUT  [MAB5SH]  86.42,44.18 180 top
PAD1  [1.6/0.8ROUND]  351.79,218.38 90 top
PAD2  [1.6/0.8ROUND]  354.33,218.38 90 top
PAD3  [1.6/0.8ROUND]  356.87,218.38 90 top
PAD4  [1.6/0.8ROUND]  359.41,218.38 90 top
PAD5  [1.6/0.8ROUND]  361.95,218.38 90 top
PAD6  [1.6/0.8ROUND]  356.87,245.05 0 top
PAD7  [1.6/0.8ROUND]  359.41,245.05 0 top
PAD8  [1.6/0.8ROUND]  356.87,242.51 0 top
PAD9  [1.6/0.8ROUND]  359.41,242.51 0 top
PAD10  [1.6/0.8ROUND]  356.87,239.97 0 top
PAD11  [1.6/0.8ROUND]  356.87,237.43 0 top
PAD12  [1.6/0.8ROUND]  359.41,237.43 0 top
PAD13  [1.6/0.8ROUND]  356.87,234.89 0 top
PAD14  [1.6/0.8ROUND]  359.41,234.89 0 top
PAD15  [1.6/0.8ROUND]  356.87,232.35 0 top
PAD16  [1.6/0.8ROUND]  356.87,229.81 0 top
PAD17  [1.6/0.8ROUND]  359.41,229.81 0 top
PAD18  [1.6/0.8ROUND]  356.87,227.27 0 top
PAD19  [1.6/0.8ROUND]  359.41,227.27 0 top
PAD20  [1.6/0.8ROUND]  356.87,224.73 0 top
PAD21  [1.6/0.8ROUND]  359.41,232.35 0 top
PAD22  [1.6/0.8ROUND]  359.41,224.73 0 top
PAD23  [1.6/0.8ROUND]  359.41,239.97 0 top
PAD24  [1.6/0.8ROUND]  354.33,224.73 0 top
PAD25  [1.6/0.8ROUND]  349.25,218.38 0 top
PAD26  [1.6/0.8ROUND]  354.33,215.84 0 top
PAD27  [1.6/0.8ROUND]  356.87,215.84 0 top
PAD28  [1.6/0.8ROUND]  359.41,215.84 0 top
PAD29  [1.6/0.8ROUND]  361.95,215.84 0 top
PAD30  [1.6/0.8ROUND]  354.33,213.3 0 top
PAD31  [1.6/0.8ROUND]  356.87,213.3 0 top
PAD32  [1.6/0.8ROUND]  359.41,213.3 0 top
PAD33  [1.6/0.8ROUND]  361.95,213.3 0 top
PAD34  [1.6/0.8ROUND]  354.33,210.76 0 top
PAD35  [1.6/0.8ROUND]  356.87,210.76 0 top
PAD36  [1.6/0.8ROUND]  359.41,210.76 0 top
PAD37  [1.6/0.8ROUND]  361.95,210.76 0 top
PAD38  [1.6/0.8ROUND]  354.33,208.22 0 top
PAD39  [1.6/0.8ROUND]  356.87,208.22 0 top
PAD40  [1.6/0.8ROUND]  359.41,208.22 0 top
PAD41  [1.6/0.8ROUND]  361.95,208.22 0 top
PAD42  [1.6/0.8ROUND]  354.33,205.68 0 top
PAD43  [1.6/0.8ROUND]  356.87,205.68 0 top
PAD44  [1.6/0.8ROUND]  359.41,205.68 0 top
PAD45  [1.6/0.8ROUND]  361.95,205.68 0 top
PAD46  [1.6/0.8ROUND]  354.33,203.14 0 top
PAD47  [1.6/0.8ROUND]  356.87,203.14 0 top
PAD48  [1.6/0.8ROUND]  359.41,203.14 0 top
PAD49  [1.6/0.8ROUND]  361.95,203.14 0 top
PAD50  [1.6/0.8ROUND]  351.79,205.68 0 top
PAD51  [1.6/0.8ROUND]  354.33,242.51 0 top
PAD52  [1.6/0.8ROUND]  351.79,245.05 0 top
PAD53  [1.6/0.8ROUND]  354.33,245.05 0 top
PAD54  [1.6/0.8ROUND]  266.7,267.91 0 top
PAD55  [1.6/0.8ROUND]  269.24,267.91 0 top
PAD56  [1.6/0.8ROUND]  271.78,267.91 0 top
PAD57  [1.6/0.8ROUND]  349.25,242.51 0 top
PAD58  [1.6/0.8ROUND]  351.79,242.51 0 top
PAD59  [1.6/0.8ROUND]  354.33,239.97 0 top
PAD60  [1.6/0.8ROUND]  266.7,265.37 0 top
PAD61  [1.6/0.8ROUND]  269.24,265.37 0 top
PAD62  [1.6/0.8ROUND]  271.78,265.37 0 top
PAD63  [1.6/0.8ROUND]  349.25,239.97 0 top
PAD64  [1.6/0.8ROUND]  351.79,239.97 0 top
PAD65  [1.6/0.8ROUND]  354.33,237.43 0 top
PAD66  [1.6/0.8ROUND]  266.7,262.83 0 top
PAD67  [1.6/0.8ROUND]  269.24,262.83 0 top
PAD68  [1.6/0.8ROUND]  271.78,262.83 0 top
PAD69  [1.6/0.8ROUND]  349.25,237.43 0 top
PAD70  [1.6/0.8ROUND]  351.79,237.43 0 top
PAD71  [1.6/0.8ROUND]  354.33,234.89 0 top
PAD72  [1.6/0.8ROUND]  266.7,260.29 0 top
PAD73  [1.6/0.8ROUND]  269.24,260.29 0 top
PAD74  [1.6/0.8ROUND]  271.78,260.29 0 top
PAD75  [1.6/0.8ROUND]  349.25,234.89 0 top
PAD76  [1.6/0.8ROUND]  351.79,234.89 0 top
PAD77  [1.6/0.8ROUND]  351.79,215.84 0 top
PAD78  [1.6/0.8ROUND]  266.7,257.75 0 top
PAD79  [1.6/0.8ROUND]  269.24,257.75 0 top
PAD80  [1.6/0.8ROUND]  271.78,257.75 0 top
PAD81  [1.6/0.8ROUND]  354.33,232.35 0 top
PAD82  [1.6/0.8ROUND]  351.79,232.35 0 top
PAD83  [1.6/0.8ROUND]  351.79,213.3 0 top
PAD84  [1.6/0.8ROUND]  266.7,255.21 0 top
PAD85  [1.6/0.8ROUND]  269.24,255.21 0 top
PAD86  [1.6/0.8ROUND]  271.78,255.21 0 top
PAD87  [1.6/0.8ROUND]  354.33,229.81 0 top
PAD88  [1.6/0.8ROUND]  351.79,229.81 0 top
PAD89  [1.6/0.8ROUND]  351.79,210.76 0 top
PAD90  [1.6/0.8ROUND]  266.7,252.67 0 top
PAD91  [1.6/0.8ROUND]  269.24,252.67 0 top
PAD92  [1.6/0.8ROUND]  271.78,252.67 0 top
PAD93  [1.6/0.8ROUND]  354.33,227.27 0 top
PAD94  [1.6/0.8ROUND]  351.79,227.27 0 top
PAD95  [1.6/0.8ROUND]  351.79,208.22 0 top
PAD96  [1.6/0.8ROUND]  349.25,208.22 0 top
PAD97  [1.6/0.8ROUND]  349.25,205.68 0 top
PAD98  [1.6/0.8ROUND]  264.16,267.91 0 top
PAD99  [1.6/0.8ROUND]  349.25,224.73 0 top
PAD100  [1.6/0.8ROUND]  351.79,224.73 0 top
PAD101  [1.6/0.8ROUND]  38.1,181.55 0 top
PAD102  [1.6/0.8ROUND]  40.64,181.55 0 top
PAD103  [1.6/0.8ROUND]  43.18,181.55 0 top
PAD104  [1.6/0.8ROUND]  45.72,181.55 0 top
PAD105  [1.6/0.8ROUND]  48.26,181.55 0 top
PAD106  [1.6/0.8ROUND]  50.8,181.55 0 top
PAD107  [1.6/0.8ROUND]  53.34,181.55 0 top
PAD108  [1.6/0.8ROUND]  55.88,181.55 0 top
PAD109  [1.6/0.8ROUND]  58.42,181.55 0 top
PAD110  [1.6/0.8ROUND]  38.1,179.01 0 top
PAD111  [1.6/0.8ROUND]  40.64,179.01 0 top
PAD112  [1.6/0.8ROUND]  43.18,179.01 0 top
PAD113  [1.6/0.8ROUND]  45.72,179.01 0 top
PAD114  [1.6/0.8ROUND]  48.26,179.01 0 top
PAD115  [1.6/0.8ROUND]  50.8,179.01 0 top
PAD116  [1.6/0.8ROUND]  53.34,179.01 0 top
PAD117  [1.6/0.8ROUND]  55.88,179.01 0 top
PAD118  [1.6/0.8ROUND]  58.42,179.01 0 top
PAD119  [1.6/0.8ROUND]  38.1,176.47 0 top
PAD120  [1.6/0.8ROUND]  40.64,176.47 0 top
PAD121  [1.6/0.8ROUND]  43.18,176.47 0 top
PAD122  [1.6/0.8ROUND]  45.72,176.47 0 top
PAD123  [1.6/0.8ROUND]  48.26,176.47 0 top
PAD124  [1.6/0.8ROUND]  50.8,176.47 0 top
PAD125  [1.6/0.8ROUND]  53.34,176.47 0 top
PAD126  [1.6/0.8ROUND]  55.88,176.47 0 top
PAD127  [1.6/0.8ROUND]  58.42,176.47 0 top
PAD128  [1.6/0.8ROUND]  38.1,173.93 0 top
PAD129  [1.6/0.8ROUND]  40.64,173.93 0 top
PAD130  [1.6/0.8ROUND]  43.18,173.93 0 top
PAD131  [1.6/0.8ROUND]  45.72,173.93 0 top
PAD132  [1.6/0.8ROUND]  48.26,173.93 0 top
PAD133  [1.6/0.8ROUND]  50.8,173.93 0 top
PAD134  [1.6/0.8ROUND]  53.34,173.93 0 top
PAD135  [1.6/0.8ROUND]  55.88,173.93 0 top
PAD136  [1.6/0.8ROUND]  58.42,173.93 0 top
PAD137  [1.6/0.8ROUND]  38.1,171.39 0 top
PAD138  [1.6/0.8ROUND]  40.64,171.39 0 top
PAD139  [1.6/0.8ROUND]  43.18,171.39 0 top
PAD140  [1.6/0.8ROUND]  45.72,171.39 0 top
PAD141  [1.6/0.8ROUND]  48.26,171.39 0 top
PAD142  [1.6/0.8ROUND]  50.8,171.39 0 top
PAD143  [1.6/0.8ROUND]  53.34,171.39 0 top
PAD144  [1.6/0.8ROUND]  55.88,171.39 0 top
PAD145  [1.6/0.8ROUND]  58.42,171.39 0 top
PAD146  [1.6/0.8ROUND]  38.1,168.85 0 top
PAD147  [1.6/0.8ROUND]  40.64,168.85 0 top
PAD148  [1.6/0.8ROUND]  43.18,168.85 0 top
PAD149  [1.6/0.8ROUND]  45.72,168.85 0 top
PAD150  [1.6/0.8ROUND]  48.26,168.85 0 top
PAD151  [1.6/0.8ROUND]  50.8,168.85 0 top
PAD152  [1.6/0.8ROUND]  53.34,168.85 0 top
PAD153  [1.6/0.8ROUND]  55.88,168.85 0 top
PAD154  [1.6/0.8ROUND]  58.42,168.85 0 top
PAD155  [1.6/0.8ROUND]  38.1,166.31 0 top
PAD156  [1.6/0.8ROUND]  40.64,166.31 0 top
PAD157  [1.6/0.8ROUND]  43.18,166.31 0 top
PAD158  [1.6/0.8ROUND]  45.72,166.31 0 top
PAD159  [1.6/0.8ROUND]  48.26,166.31 0 top
PAD160  [1.6/0.8ROUND]  50.8,166.31 0 top
PAD161  [1.6/0.8ROUND]  53.34,166.31 0 top
PAD162  [1.6/0.8ROUND]  55.88,166.31 0 top
PAD163  [1.6/0.8ROUND]  58.42,166.31 0 top
PAD164  [1.6/0.8ROUND]  38.1,163.77 0 top
PAD165  [1.6/0.8ROUND]  40.64,163.77 0 top
PAD166  [1.6/0.8ROUND]  43.18,163.77 0 top
PAD167  [1.6/0.8ROUND]  45.72,163.77 0 top
PAD168  [1.6/0.8ROUND]  48.26,163.77 0 top
PAD169  [1.6/0.8ROUND]  264.16,250.13 0 top
PAD170  [1.6/0.8ROUND]  266.7,250.13 0 top
PAD171  [1.6/0.8ROUND]  269.24,250.13 0 top
PAD172  [1.6/0.8ROUND]  271.78,250.13 0 top
PAD173  [1.6/0.8ROUND]  38.1,161.23 0 top
PAD174  [1.6/0.8ROUND]  40.64,161.23 0 top
PAD175  [1.6/0.8ROUND]  43.18,161.23 0 top
PAD176  [1.6/0.8ROUND]  45.72,161.23 0 top
PAD177  [1.6/0.8ROUND]  48.26,161.23 0 top
PAD178  [1.6/0.8ROUND]  264.16,247.59 0 top
PAD179  [1.6/0.8ROUND]  266.7,247.59 0 top
PAD180  [1.6/0.8ROUND]  269.24,247.59 0 top
PAD181  [1.6/0.8ROUND]  271.78,247.59 0 top
PAD182  [1.6/0.8ROUND]  50.8,163.77 0 top
PAD183  [1.6/0.8ROUND]  53.34,163.77 0 top
PAD184  [1.6/0.8ROUND]  55.88,163.77 0 top
PAD185  [1.6/0.8ROUND]  58.42,163.77 0 top
PAD186  [1.6/0.8ROUND]  50.8,161.23 0 top
PAD187  [1.6/0.8ROUND]  264.16,245.05 0 top
PAD188  [1.6/0.8ROUND]  266.7,245.05 0 top
PAD189  [1.6/0.8ROUND]  269.24,245.05 0 top
PAD190  [1.6/0.8ROUND]  271.78,245.05 0 top
PAD191  [1.6/0.8ROUND]  264.16,252.67 90 top
PAD192  [1.6/0.8ROUND]  264.16,255.21 90 top
PAD193  [1.6/0.8ROUND]  264.16,257.75 90 top
PAD194  [1.6/0.8ROUND]  264.16,260.29 90 top
PAD195  [1.6/0.8ROUND]  264.16,262.83 90 top
PAD196  [1.6/0.8ROUND]  264.16,242.51 0 top
PAD197  [1.6/0.8ROUND]  266.7,242.51 0 top
PAD198  [1.6/0.8ROUND]  269.24,242.51 0 top
PAD199  [1.6/0.8ROUND]  271.78,242.51 0 top
PAD200  [1.6/0.8ROUND]  264.16,265.37 90 top
PAD201  [1.6/0.8ROUND]  60.96,181.55 0 top
PAD202  [1.6/0.8ROUND]  63.5,181.55 0 top
PAD203  [1.6/0.8ROUND]  66.04,181.55 0 top
PAD204  [1.6/0.8ROUND]  68.58,181.55 0 top
PAD205  [1.6/0.8ROUND]  71.12,181.55 0 top
PAD206  [1.6/0.8ROUND]  60.96,199.33 0 top
PAD207  [1.6/0.8ROUND]  60.96,184.09 0 top
PAD208  [1.6/0.8ROUND]  60.96,179.01 0 top
PAD209  [1.6/0.8ROUND]  63.5,179.01 0 top
PAD210  [1.6/0.8ROUND]  66.04,179.01 0 top
PAD211  [1.6/0.8ROUND]  68.58,179.01 0 top
PAD212  [1.6/0.8ROUND]  71.12,179.01 0 top
PAD213  [1.6/0.8ROUND]  66.04,184.09 0 top
PAD214  [1.6/0.8ROUND]  58.42,184.09 0 top
PAD215  [1.6/0.8ROUND]  60.96,176.47 0 top
PAD216  [1.6/0.8ROUND]  63.5,176.47 0 top
PAD217  [1.6/0.8ROUND]  66.04,176.47 0 top
PAD218  [1.6/0.8ROUND]  68.58,176.47 0 top
PAD219  [1.6/0.8ROUND]  71.12,176.47 0 top
PAD220  [1.6/0.8ROUND]  71.12,184.09 0 top
PAD221  [1.6/0.8ROUND]  55.88,184.09 0 top
PAD222  [1.6/0.8ROUND]  60.96,173.93 0 top
PAD223  [1.6/0.8ROUND]  63.5,173.93 0 top
PAD224  [1.6/0.8ROUND]  66.04,173.93 0 top
PAD225  [1.6/0.8ROUND]  68.58,173.93 0 top
PAD226  [1.6/0.8ROUND]  71.12,173.93 0 top
PAD227  [1.6/0.8ROUND]  68.58,184.09 0 top
PAD228  [1.6/0.8ROUND]  53.34,184.09 0 top
PAD229  [1.6/0.8ROUND]  60.96,171.39 0 top
PAD230  [1.6/0.8ROUND]  63.5,171.39 0 top
PAD231  [1.6/0.8ROUND]  66.04,171.39 0 top
PAD232  [1.6/0.8ROUND]  68.58,171.39 0 top
PAD233  [1.6/0.8ROUND]  71.12,171.39 0 top
PAD234  [1.6/0.8ROUND]  60.96,189.17 0 top
PAD235  [1.6/0.8ROUND]  48.26,186.63 0 top
PAD236  [1.6/0.8ROUND]  60.96,168.85 0 top
PAD237  [1.6/0.8ROUND]  63.5,168.85 0 top
PAD238  [1.6/0.8ROUND]  66.04,168.85 0 top
PAD239  [1.6/0.8ROUND]  68.58,168.85 0 top
PAD240  [1.6/0.8ROUND]  71.12,168.85 0 top
PAD241  [1.6/0.8ROUND]  63.5,184.09 0 top
PAD242  [1.6/0.8ROUND]  50.8,184.09 0 top
PAD243  [1.6/0.8ROUND]  60.96,166.31 0 top
PAD244  [1.6/0.8ROUND]  63.5,166.31 0 top
PAD245  [1.6/0.8ROUND]  66.04,166.31 0 top
PAD246  [1.6/0.8ROUND]  68.58,166.31 0 top
PAD247  [1.6/0.8ROUND]  71.12,166.31 0 top
PAD248  [1.6/0.8ROUND]  71.12,161.23 0 top
PAD249  [1.6/0.8ROUND]  58.42,161.23 0 top
PAD250  [1.6/0.8ROUND]  60.96,163.77 0 top
PAD251  [1.6/0.8ROUND]  63.5,163.77 0 top
PAD252  [1.6/0.8ROUND]  66.04,163.77 0 top
PAD253  [1.6/0.8ROUND]  68.58,163.77 0 top
PAD254  [1.6/0.8ROUND]  71.12,163.77 0 top
PAD255  [1.6/0.8ROUND]  53.34,161.23 0 top
PAD256  [1.6/0.8ROUND]  55.88,161.23 0 top
PAD257  [1.6/0.8ROUND]  60.96,161.23 0 top
PAD258  [1.6/0.8ROUND]  63.5,161.23 0 top
PAD259  [1.6/0.8ROUND]  66.04,161.23 0 top
PAD260  [1.6/0.8ROUND]  68.58,161.23 0 top
PAD261  [1.6/0.8ROUND]  48.26,184.09 0 top
PAD262  [1.6/0.8ROUND]  68.58,186.63 0 top
PAD263  [1.6/0.8ROUND]  71.12,186.63 0 top
PAD264  [1.6/0.8ROUND]  60.96,186.63 0 top
PAD265  [1.6/0.8ROUND]  63.5,199.33 0 top
PAD266  [1.6/0.8ROUND]  66.04,199.33 0 top
PAD267  [1.6/0.8ROUND]  68.58,199.33 0 top
PAD268  [1.6/0.8ROUND]  71.12,199.33 0 top
PAD269  [1.6/0.8ROUND]  63.5,196.79 0 top
PAD270  [1.6/0.8ROUND]  66.04,196.79 0 top
PAD271  [1.6/0.8ROUND]  68.58,196.79 0 top
PAD272  [1.6/0.8ROUND]  71.12,196.79 0 top
PAD273  [1.6/0.8ROUND]  63.5,194.25 0 top
PAD274  [1.6/0.8ROUND]  66.04,194.25 0 top
PAD275  [1.6/0.8ROUND]  68.58,194.25 0 top
PAD276  [1.6/0.8ROUND]  71.12,194.25 0 top
PAD277  [1.6/0.8ROUND]  63.5,191.71 0 top
PAD278  [1.6/0.8ROUND]  66.04,191.71 0 top
PAD279  [1.6/0.8ROUND]  68.58,191.71 0 top
PAD280  [1.6/0.8ROUND]  71.12,191.71 0 top
PAD281  [1.6/0.8ROUND]  63.5,189.17 0 top
PAD282  [1.6/0.8ROUND]  66.04,189.17 0 top
PAD283  [1.6/0.8ROUND]  68.58,189.17 0 top
PAD284  [1.6/0.8ROUND]  71.12,189.17 0 top
PAD285  [1.6/0.8ROUND]  63.5,186.63 0 top
PAD286  [1.6/0.8ROUND]  66.04,186.63 0 top
PAD287  [1.6/0.8ROUND]  35.56,171.39 90 top
PAD288  [1.6/0.8ROUND]  35.56,179.01 90 top
PAD289  [1.6/0.8ROUND]  60.96,217.11 90 top
PAD290  [1.6/0.8ROUND]  63.5,214.57 90 top
PAD291  [1.6/0.8ROUND]  48.26,217.11 90 top
PAD292  [1.6/0.8ROUND]  35.56,173.93 90 top
PAD293  [1.6/0.8ROUND]  63.5,217.11 90 top
PAD294  [1.6/0.8ROUND]  60.96,214.57 90 top
PAD295  [1.6/0.8ROUND]  66.04,214.57 90 top
PAD296  [1.6/0.8ROUND]  43.18,184.09 90 top
PAD297  [1.6/0.8ROUND]  35.56,176.47 90 top
PAD298  [1.6/0.8ROUND]  66.04,217.11 90 top
PAD299  [1.6/0.8ROUND]  68.58,217.11 90 top
PAD300  [1.6/0.8ROUND]  68.58,214.57 90 top
PAD301  [1.6/0.8ROUND]  45.72,184.09 90 top
PAD302  [1.6/0.8ROUND]  60.96,201.87 90 top
PAD303  [1.6/0.8ROUND]  60.96,204.41 90 top
PAD304  [1.6/0.8ROUND]  60.96,206.95 90 top
PAD305  [1.6/0.8ROUND]  60.96,209.49 90 top
PAD306  [1.6/0.8ROUND]  60.96,212.03 90 top
PAD307  [1.6/0.8ROUND]  63.5,201.87 90 top
PAD308  [1.6/0.8ROUND]  63.5,204.41 90 top
PAD309  [1.6/0.8ROUND]  63.5,206.95 90 top
PAD310  [1.6/0.8ROUND]  63.5,209.49 90 top
PAD311  [1.6/0.8ROUND]  63.5,212.03 90 top
PAD312  [1.6/0.8ROUND]  66.04,201.87 90 top
PAD313  [1.6/0.8ROUND]  66.04,204.41 90 top
PAD314  [1.6/0.8ROUND]  66.04,206.95 90 top
PAD315  [1.6/0.8ROUND]  66.04,209.49 90 top
PAD316  [1.6/0.8ROUND]  66.04,212.03 90 top
PAD317  [1.6/0.8ROUND]  68.58,201.87 90 top
PAD318  [1.6/0.8ROUND]  68.58,204.41 90 top
PAD319  [1.6/0.8ROUND]  68.58,206.95 90 top
PAD320  [1.6/0.8ROUND]  68.58,209.49 90 top
PAD321  [1.6/0.8ROUND]  68.58,212.03 90 top
PAD322  [1.6/0.8ROUND]  71.12,201.87 90 top
PAD323  [1.6/0.8ROUND]  71.12,204.41 90 top
PAD324  [1.6/0.8ROUND]  71.12,206.95 90 top
PAD325  [1.6/0.8ROUND]  71.12,209.49 90 top
PAD326  [1.6/0.8ROUND]  48.26,250.13 0 top
PAD327  [1.6/0.8ROUND]  48.26,245.05 0 top
PAD328  [1.6/0.8ROUND]  48.26,247.59 0 top
PAD329  [1.6/0.8ROUND]  48.26,212.03 0 top
PAD330  [1.6/0.8ROUND]  48.26,214.57 0 top
PAD331  [1.6/0.8ROUND]  48.26,209.49 0 top
PAD332  [1.6/0.8ROUND]  43.18,199.33 0 top
PAD333  [1.6/0.8ROUND]  45.72,199.33 0 top
PAD334  [1.6/0.8ROUND]  35.56,163.77 90 top
PAD335  [1.6/0.8ROUND]  35.56,166.31 90 top
PAD336  [1.6/0.8ROUND]  48.26,201.87 0 top
PAD337  [1.6/0.8ROUND]  58.42,201.87 0 top
PAD338  [1.6/0.8ROUND]  35.56,168.85 90 top
PAD339  [1.6/0.8ROUND]  58.42,217.11 0 top
PAD340  [1.6/0.8ROUND]  45.72,217.11 0 top
PAD341  [1.6/0.8ROUND]  43.18,196.79 0 top
PAD342  [1.6/0.8ROUND]  58.42,206.95 0 top
PAD343  [1.6/0.8ROUND]  58.42,209.49 0 top
PAD344  [1.6/0.8ROUND]  45.72,196.79 0 top
PAD345  [1.6/0.8ROUND]  45.72,201.87 0 top
PAD346  [1.6/0.8ROUND]  45.72,204.41 0 top
PAD347  [1.6/0.8ROUND]  58.42,204.41 0 top
PAD348  [1.6/0.8ROUND]  45.72,212.03 0 top
PAD349  [1.6/0.8ROUND]  45.72,214.57 0 top
PAD350  [1.6/0.8ROUND]  43.18,206.95 0 top
PAD351  [1.6/0.8ROUND]  43.18,204.41 0 top
PAD352  [1.6/0.8ROUND]  43.18,194.25 0 top
PAD353  [1.6/0.8ROUND]  45.72,194.25 0 top
PAD354  [1.6/0.8ROUND]  48.26,206.95 0 top
PAD355  [1.6/0.8ROUND]  48.26,204.41 0 top
PAD356  [1.6/0.8ROUND]  58.42,214.57 0 top
PAD357  [1.6/0.8ROUND]  45.72,209.49 0 top
PAD358  [1.6/0.8ROUND]  43.18,217.11 0 top
PAD359  [1.6/0.8ROUND]  43.18,214.57 0 top
PAD360  [1.6/0.8ROUND]  45.72,191.71 0 top
PAD361  [1.6/0.8ROUND]  45.72,186.63 0 top
PAD362  [1.6/0.8ROUND]  43.18,212.03 0 top
PAD363  [1.6/0.8ROUND]  43.18,209.49 0 top
PAD364  [1.6/0.8ROUND]  53.34,201.87 0 top
PAD365  [1.6/0.8ROUND]  58.42,212.03 0 top
PAD366  [1.6/0.8ROUND]  181.29,3.75 90 top
PAD367  [1.6/0.8ROUND]  181.29,6.29 90 top
PAD368  [1.6/0.8ROUND]  43.18,189.17 0 top
PAD369  [1.6/0.8ROUND]  45.72,189.17 0 top
PAD370  [1.6/0.8ROUND]  181.29,8.83 90 top
PAD371  [1.6/0.8ROUND]  181.29,11.37 90 top
PAD372  [1.6/0.8ROUND]  50.8,201.87 0 top
PAD373  [1.6/0.8ROUND]  55.88,201.87 0 top
PAD374  [1.6/0.8ROUND]  181.29,13.91 90 top
PAD375  [1.6/0.8ROUND]  294.64,3.75 90 top
PAD376  [1.6/0.8ROUND]  45.72,206.95 0 top
PAD377  [1.6/0.8ROUND]  43.18,186.63 0 top
PAD378  [1.6/0.8ROUND]  294.64,6.29 90 top
PAD379  [1.6/0.8ROUND]  294.64,8.83 90 top
PAD380  [1.6/0.8ROUND]  43.18,191.71 0 top
PAD381  [1.6/0.8ROUND]  43.18,201.87 0 top
PAD382  [1.6/0.8ROUND]  294.64,11.37 90 top
PAD383  [1.6/0.8ROUND]  294.64,13.91 90 top
PAD384  [1.6/0.8ROUND]  332.74,13.91 0 top
PAD385  [1.6/0.8ROUND]  335.28,13.91 0 top
PAD386  [1.6/0.8ROUND]  183.83,3.75 90 top
PAD387  [1.6/0.8ROUND]  183.83,6.29 90 top
PAD388  [1.6/0.8ROUND]  183.83,8.83 90 top
PAD389  [1.6/0.8ROUND]  183.83,11.37 90 top
PAD390  [1.6/0.8ROUND]  183.83,13.91 90 top
PAD391  [1.6/0.8ROUND]  297.18,3.75 90 top
PAD392  [1.6/0.8ROUND]  297.18,6.29 90 top
PAD393  [1.6/0.8ROUND]  297.18,8.83 90 top
PAD394  [1.6/0.8ROUND]  297.18,11.37 90 top
PAD395  [1.6/0.8ROUND]  297.18,13.91 90 top
PAD396  [1.6/0.8ROUND]  332.74,11.37 0 top
PAD397  [1.6/0.8ROUND]  335.28,11.37 0 top
PAD398  [1.6/0.8ROUND]  193.99,3.75 90 top
PAD399  [1.6/0.8ROUND]  186.37,6.29 90 top
PAD400  [1.6/0.8ROUND]  186.37,8.83 90 top
PAD401  [1.6/0.8ROUND]  186.37,11.37 90 top
PAD402  [1.6/0.8ROUND]  186.37,13.91 90 top
PAD403  [1.6/0.8ROUND]  299.72,3.75 90 top
PAD404  [1.6/0.8ROUND]  299.72,6.29 90 top
PAD405  [1.6/0.8ROUND]  299.72,8.83 90 top
PAD406  [1.6/0.8ROUND]  299.72,11.37 90 top
PAD407  [1.6/0.8ROUND]  299.72,13.91 90 top
PAD408  [1.6/0.8ROUND]  332.74,8.83 0 top
PAD409  [1.6/0.8ROUND]  335.28,8.83 0 top
PAD410  [1.6/0.8ROUND]  186.37,3.75 90 top
PAD411  [1.6/0.8ROUND]  188.91,6.29 90 top
PAD412  [1.6/0.8ROUND]  188.91,8.83 90 top
PAD413  [1.6/0.8ROUND]  188.91,11.37 90 top
PAD414  [1.6/0.8ROUND]  188.91,13.91 90 top
PAD415  [1.6/0.8ROUND]  302.26,3.75 90 top
PAD416  [1.6/0.8ROUND]  302.26,6.29 90 top
PAD417  [1.6/0.8ROUND]  302.26,8.83 90 top
PAD418  [1.6/0.8ROUND]  302.26,11.37 90 top
PAD419  [1.6/0.8ROUND]  302.26,13.91 90 top
PAD420  [1.6/0.8ROUND]  332.74,6.29 0 top
PAD421  [1.6/0.8ROUND]  335.28,6.29 0 top
PAD422  [1.6/0.8ROUND]  188.91,3.75 90 top
PAD423  [1.6/0.8ROUND]  191.45,6.29 90 top
PAD424  [1.6/0.8ROUND]  191.45,8.83 90 top
PAD425  [1.6/0.8ROUND]  191.45,11.37 90 top
PAD426  [1.6/0.8ROUND]  191.45,13.91 90 top
PAD427  [1.6/0.8ROUND]  304.8,3.75 90 top
PAD428  [1.6/0.8ROUND]  304.8,6.29 90 top
PAD429  [1.6/0.8ROUND]  304.8,8.83 90 top
PAD430  [1.6/0.8ROUND]  304.8,11.37 90 top
PAD431  [1.6/0.8ROUND]  304.8,13.91 90 top
PAD432  [1.6/0.8ROUND]  332.74,3.75 0 top
PAD433  [1.6/0.8ROUND]  335.28,3.75 0 top
PAD434  [1.6/0.8ROUND]  191.45,3.75 90 top
PAD435  [1.6/0.8ROUND]  193.99,6.29 90 top
PAD436  [1.6/0.8ROUND]  193.99,8.83 90 top
PAD437  [1.6/0.8ROUND]  193.99,11.37 90 top
PAD438  [1.6/0.8ROUND]  193.99,13.91 90 top
PAD439  [1.6/0.8ROUND]  307.34,3.75 90 top
PAD440  [1.6/0.8ROUND]  307.34,6.29 90 top
PAD441  [1.6/0.8ROUND]  307.34,8.83 90 top
PAD442  [1.6/0.8ROUND]  307.34,11.37 90 top
PAD443  [1.6/0.8ROUND]  307.34,13.91 90 top
PAD444  [1.6/0.8ROUND]  337.82,13.91 0 top
PAD446  [1.6/0.8ROUND]  196.53,3.75 90 top
PAD447  [1.6/0.8ROUND]  196.53,6.29 90 top
PAD448  [1.6/0.8ROUND]  196.53,8.83 90 top
PAD449  [1.6/0.8ROUND]  196.53,11.37 90 top
PAD450  [1.6/0.8ROUND]  196.53,13.91 90 top
PAD451  [1.6/0.8ROUND]  309.88,3.75 90 top
PAD452  [1.6/0.8ROUND]  309.88,6.29 90 top
PAD453  [1.6/0.8ROUND]  309.88,8.83 90 top
PAD454  [1.6/0.8ROUND]  309.88,11.37 90 top
PAD455  [1.6/0.8ROUND]  309.88,13.91 90 top
PAD456  [1.6/0.8ROUND]  337.82,11.37 0 top
PAD458  [1.6/0.8ROUND]  199.07,3.75 90 top
PAD459  [1.6/0.8ROUND]  199.07,6.29 90 top
PAD460  [1.6/0.8ROUND]  199.07,8.83 90 top
PAD461  [1.6/0.8ROUND]  199.07,11.37 90 top
PAD462  [1.6/0.8ROUND]  199.07,13.91 90 top
PAD463  [1.6/0.8ROUND]  312.42,3.75 90 top
PAD464  [1.6/0.8ROUND]  312.42,6.29 90 top
PAD465  [1.6/0.8ROUND]  312.42,8.83 90 top
PAD466  [1.6/0.8ROUND]  312.42,11.37 90 top
PAD467  [1.6/0.8ROUND]  312.42,13.91 90 top
PAD468  [1.6/0.8ROUND]  337.82,8.83 0 top
PAD470  [1.6/0.8ROUND]  201.61,3.75 90 top
PAD471  [1.6/0.8ROUND]  201.61,6.29 90 top
PAD472  [1.6/0.8ROUND]  201.61,8.83 90 top
PAD473  [1.6/0.8ROUND]  201.61,11.37 90 top
PAD474  [1.6/0.8ROUND]  201.61,13.91 90 top
PAD475  [1.6/0.8ROUND]  314.96,3.75 90 top
PAD476  [1.6/0.8ROUND]  314.96,6.29 90 top
PAD477  [1.6/0.8ROUND]  314.96,8.83 90 top
PAD478  [1.6/0.8ROUND]  314.96,11.37 90 top
PAD479  [1.6/0.8ROUND]  314.96,13.91 90 top
PAD480  [1.6/0.8ROUND]  337.82,6.29 0 top
PAD482  [1.6/0.8ROUND]  204.15,3.75 90 top
PAD483  [1.6/0.8ROUND]  204.15,6.29 90 top
PAD484  [1.6/0.8ROUND]  204.15,8.83 90 top
PAD485  [1.6/0.8ROUND]  204.15,11.37 90 top
PAD486  [1.6/0.8ROUND]  204.15,13.91 90 top
PAD487  [1.6/0.8ROUND]  317.5,3.75 90 top
PAD488  [1.6/0.8ROUND]  317.5,6.29 90 top
PAD489  [1.6/0.8ROUND]  317.5,8.83 90 top
PAD490  [1.6/0.8ROUND]  317.5,11.37 90 top
PAD491  [1.6/0.8ROUND]  317.5,13.91 90 top
PAD492  [1.6/0.8ROUND]  337.82,3.75 0 top
PAD494  [1.6/0.8ROUND]  206.69,3.75 90 top
PAD495  [1.6/0.8ROUND]  206.69,6.29 90 top
PAD496  [1.6/0.8ROUND]  206.69,8.83 90 top
PAD497  [1.6/0.8ROUND]  206.69,11.37 90 top
PAD498  [1.6/0.8ROUND]  206.69,13.91 90 top
PAD499  [1.6/0.8ROUND]  320.04,3.75 90 top
PAD500  [1.6/0.8ROUND]  320.04,6.29 90 top
PAD501  [1.6/0.8ROUND]  320.04,8.83 90 top
PAD502  [1.6/0.8ROUND]  320.04,11.37 90 top
PAD503  [1.6/0.8ROUND]  320.04,13.91 90 top
PAD506  [1.6/0.8ROUND]  209.23,3.75 90 top
PAD507  [1.6/0.8ROUND]  209.23,6.29 90 top
PAD508  [1.6/0.8ROUND]  209.23,8.83 90 top
PAD509  [1.6/0.8ROUND]  209.23,11.37 90 top
PAD510  [1.6/0.8ROUND]  209.23,13.91 90 top
PAD511  [1.6/0.8ROUND]  322.58,3.75 90 top
PAD512  [1.6/0.8ROUND]  322.58,6.29 90 top
PAD513  [1.6/0.8ROUND]  322.58,8.83 90 top
PAD514  [1.6/0.8ROUND]  322.58,11.37 90 top
PAD515  [1.6/0.8ROUND]  322.58,13.91 90 top
PAD518  [1.6/0.8ROUND]  211.77,3.75 90 top
PAD519  [1.6/0.8ROUND]  211.77,6.29 90 top
PAD520  [1.6/0.8ROUND]  211.77,8.83 90 top
PAD521  [1.6/0.8ROUND]  211.77,11.37 90 top
PAD522  [1.6/0.8ROUND]  211.77,13.91 90 top
PAD523  [1.6/0.8ROUND]  325.12,3.75 90 top
PAD524  [1.6/0.8ROUND]  325.12,6.29 90 top
PAD525  [1.6/0.8ROUND]  325.12,8.83 90 top
PAD526  [1.6/0.8ROUND]  325.12,11.37 90 top
PAD527  [1.6/0.8ROUND]  325.12,13.91 90 top
PAD530  [1.6/0.8ROUND]  214.31,3.75 90 top
PAD531  [1.6/0.8ROUND]  214.31,6.29 90 top
PAD532  [1.6/0.8ROUND]  214.31,8.83 90 top
PAD533  [1.6/0.8ROUND]  214.31,11.37 90 top
PAD534  [1.6/0.8ROUND]  214.31,13.91 90 top
PAD535  [1.6/0.8ROUND]  327.66,3.75 90 top
PAD536  [1.6/0.8ROUND]  327.66,6.29 90 top
PAD537  [1.6/0.8ROUND]  327.66,8.83 90 top
PAD538  [1.6/0.8ROUND]  327.66,11.37 90 top
PAD539  [1.6/0.8ROUND]  327.66,13.91 90 top
PAD542  [1.6/0.8ROUND]  216.85,3.75 90 top
PAD543  [1.6/0.8ROUND]  216.85,6.29 90 top
PAD544  [1.6/0.8ROUND]  216.85,8.83 90 top
PAD545  [1.6/0.8ROUND]  216.85,11.37 90 top
PAD546  [1.6/0.8ROUND]  216.85,13.91 90 top
PAD547  [1.6/0.8ROUND]  330.2,3.75 90 top